# EAGLE design Rev0.1 (EAGLE 7.1.0)
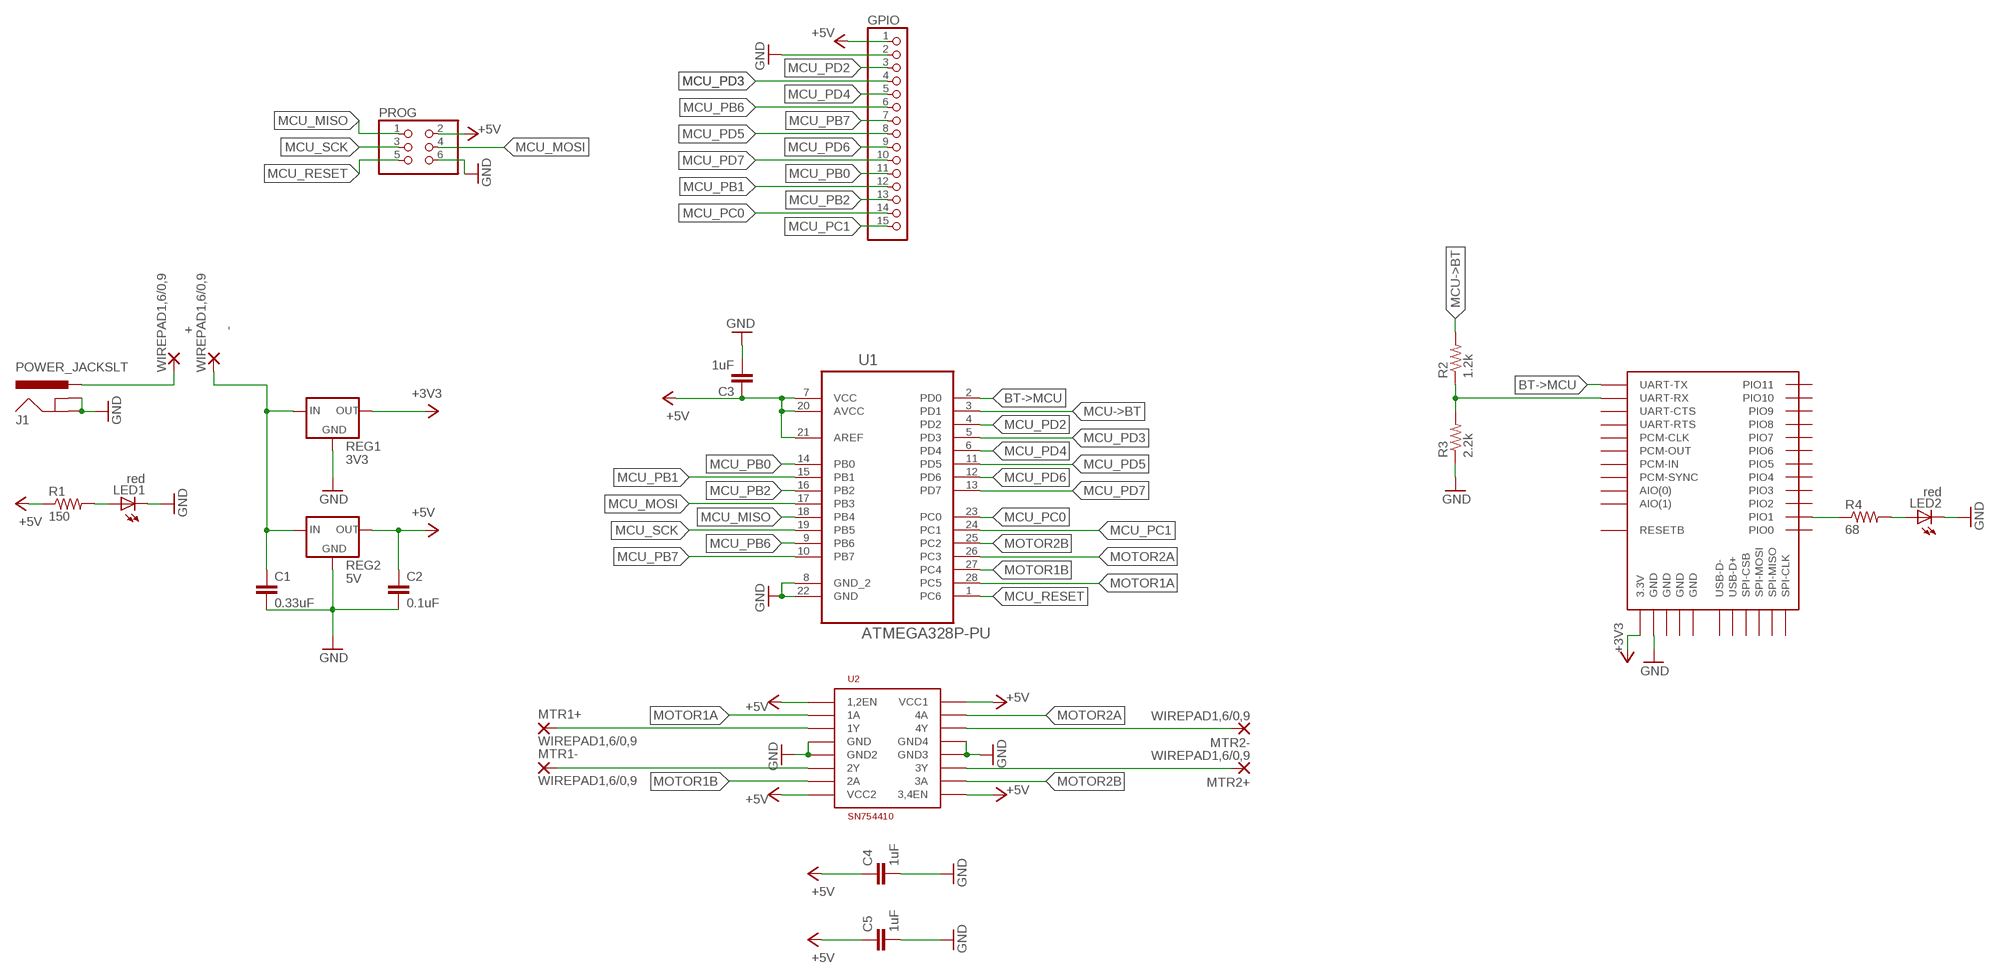
[diagram p0: schematic, sheet 1]

## Parts
+  WIREPAD1,6/0,9  [1,6/0,9]
-  WIREPAD1,6/0,9  [1,6/0,9]
C1  0.33uF  CAP0805  [0805]
C2  0.1uF  CAP0805  [0805]
C3  1uF  CAP0805  [0805]
C4  1uF  CAP0805  [0805]
C5  1uF  CAP0805  [0805]
GPIO  PINHD-1X15  [1X15]
J1  POWER_JACKSLT  [POWER_JACK_SLOT]
LED1  red  LEDCHIP-LED0805  [CHIP-LED0805]
LED2  red  LEDCHIP-LED0805  [CHIP-LED0805]
MTR1+  WIREPAD1,6/0,9  [1,6/0,9]
MTR1-  WIREPAD1,6/0,9  [1,6/0,9]
MTR2+  WIREPAD1,6/0,9  [1,6/0,9]
MTR2-  WIREPAD1,6/0,9  [1,6/0,9]
PROG  PINHD-2X3  [2X03]
R1  150  R-US_R0805  [R0805]
R2  1.2k  R-US_R0805  [R0805]
R3  2.2k  R-US_R0805  [R0805]
R4  68  R-US_R0805  [R0805]
REG1  3V3  LREG_3V3  [TO220V]
REG2  5V  LREG_5V  [TO220V]
U1  ATMEGA328P-PU  [DIP254P762X457-28]
U2  H-BRIDGE  [DIP16]
U$1  BTM400_6B  [BTM400_6B]

## Nets
+3V3 [PWR]: REG1.3(OUT) U$1.3.3V
+5V [PWR]: C2.1 C3.1 C4.1 C5.1 GPIO.1 PROG.2 R1.1 REG2.3(OUT) U1.7(VCC) U1.20(AVCC) U1.21(AREF) U2.P$1(1,2EN) U2.P$8(VCC2) U2.P$9(3,4EN) U2.P$16(VCC1)
BT->MCU: U1.2(PD0) U$1.UART-TX
GND [GND]: C1.2 C2.2 C3.2 C4.2 C5.2 GPIO.2 J1.GND@1(GNDBREAK) J1.GND@2(GND) LED1.C LED2.C PROG.6 R3.1 REG1.2(GND) REG2.2(GND) U1.8(GND_2) U1.22(GND) U2.P$4(GND) U2.P$5(GND2) U2.P$12(GND3) U2.P$13(GND4) U$1.GND@1(GND)
MCU->BT: R2.2 U1.3(PD1)
MCU_MISO: PROG.1 U1.18(PB4)
MCU_MOSI: PROG.4 U1.17(PB3)
MCU_PB0: GPIO.11 U1.14(PB0)
MCU_PB1: GPIO.12 U1.15(PB1)
MCU_PB2: GPIO.13 U1.16(PB2)
MCU_PB6: GPIO.6 U1.9(PB6)
MCU_PB7: GPIO.7 U1.10(PB7)
MCU_PC0: GPIO.14 U1.23(PC0)
MCU_PC1: GPIO.15 U1.24(PC1)
MCU_PD2: GPIO.3 U1.4(PD2)
MCU_PD3: GPIO.4 U1.5(PD3)
MCU_PD4: GPIO.5 U1.6(PD4)
MCU_PD5: GPIO.8 U1.11(PD5)
MCU_PD6: GPIO.9 U1.12(PD6)
MCU_PD7: GPIO.10 U1.13(PD7)
MCU_RESET: PROG.5 U1.1(PC6)
MCU_SCK: PROG.3 U1.19(PB5)
MOTOR1A: U1.28(PC5) U2.P$2(1A)
MOTOR1B: U1.27(PC4) U2.P$7(2A)
MOTOR2A: U1.26(PC3) U2.P$15(4A)
MOTOR2B: U1.25(PC2) U2.P$10(3A)
N$1 [PWR]: -.1(P) C1.1 REG1.1(IN) REG2.1(IN)
N$2: LED1.A R1.2
N$3: +.1(P) J1.PWR
N$4 [PWR]: MTR1+.1(P) U2.P$3(1Y)
N$5: MTR1-.1(P) U2.P$6(2Y)
N$6: MTR2-.1(P) U2.P$14(4Y)
N$7: MTR2+.1(P) U2.P$11(3Y)
N$8: R2.1 R3.2 U$1.UART-RX
N$9: R4.1 U$1.PIO(1)(PIO1)
N$10: LED2.A R4.2
Unconnected: U$1.AIO(0) U$1.AIO(1) U$1.PCM-CLK U$1.PCM-IN U$1.PCM-OUT U$1.PCM-SYNC U$1.PIO(0)(PIO0) U$1.PIO(2)(PIO2) U$1.PIO(3)(PIO3) U$1.PIO(4)(PIO4) U$1.PIO(5)(PIO5) U$1.PIO(6)(PIO6) U$1.PIO(7)(PIO7) U$1.PIO(8)(PIO8) U$1.PIO(9)(PIO9) U$1.PIO(10)(PIO10) U$1.PIO(11)(PIO11) U$1.RESETB U$1.SPI-CLK U$1.SPI-CSB U$1.SPI-MISO U$1.SPI-MOSI U$1.UART-CTS U$1.UART-RTS U$1.USB-D+ U$1.USB-D-

## Power pins joined to a net without a drawn wire
GND: U$1.GND@2(GND) U$1.GND@3(GND) U$1.GND@4(GND)

## Library data of the parts
+ - MTR1+ MTR1- MTR2+ MTR2- = wirepad:WIREPAD: Wire PAD connect wire on PCB
C1-C5 = SparkFun-Capacitors:CAP: Capacitor Standard 0603 ceramic capacitor, and 0.1" leaded capacitor.
GPIO = pinhead:PINHD-1X15: PIN HEADER
J1 = SparkFun-Connectors:POWER_JACK: Power Jack This is the standard 5.5mm barrel jack for power. The PTH is the most common, proven, reliable, footprint. The Slot footprint only works if the mill layer is transmitted to the PCB fab house so be warned. Mating wall wart : TOL-00298 (and others); PROD_ID: PRT-00119
LED1 LED2 = adafruit:LED: LED OSRAM: - CHIPLED LG R971, LG N971, LY N971, LG Q971, LY Q971, LO R971, LY R971 LH N974, LH R974 LS Q976, LO Q976, LY Q976 LO Q996 - Hyper CHIPLED LW Q18S LB Q993, LB Q99A, LB R99A - SideLED LS A670, LO A670, LY A670, LG A670, LP A670 LB A673, LV A673, LT A673, LW A673 LH A674 LY A675 LS A676, LA A676, LO A676, LY A676, LW A676 LS A679, LY A679, LG A679 - Hyper Micro SIDELED® LS Y876, LA Y876, LO Y876, LY Y876 LT Y87S - SmartLED LW L88C, LW L88S LB L89C, LB L89S, LG L890 LS L89K, LO L89K, LY L89K LS L896, LA L896, LO L896, LY L896 - TOPLED LS T670, LO T670, LY T670, LG T670, LP T670 LSG T670, LSP T670, LSY T670, LOP T670, LYG T670 LG T671, LOG T671, LSG T671 LB T673, LV T673, LT T673, LW T673 LH T674 LS T676, LA T676, LO T676, LY T676, LB T676, LH T676, LSB T676, LW T676 LB T67C, LV T67C, LT T67C, LS T67K, LO T67K, LY T67K, LW E67C LS E67B, LA E67B, LO E67B, LY E67B, LB E67C, LV E67C, LT E67C LW T67C LS T679, LY T679, LG T679 LS T770, LO T770, LY T770, LG T770, LP T770 LB T773, LV T773, LT T773, LW T773 LH T774 LS E675, LA E675, LY E675, LS T675 LS T776, LA T776, LO T776, LY T776, LB T776 LHGB T686 LT T68C, LB T68C - Hyper Mini TOPLED® LB M676 - Mini TOPLED Santana® LG M470 LS M47K, LO M47K, LY M47K Source: http://www.osram.convergy.de/
PROG = pinhead:PINHD-2X3: PIN HEADER
R1-R4 = resistor:R-US_: RESISTOR, American symbol
REG1 = BayouBot:LREG_3V3: 3.3V Linear Regulator Vertically mounted 3.3V linear regulator. Pinout is for the UA78M33CKCS.
REG2 = BayouBot:LREG_5V: 5V Linear Regulator A vertically mounted linear regulator. Pinout is for the LM7805CT.
U1 = Atmel_By_element14_Batch_1-00:ATMEGA328P-PU: 8-bit Microcontroller with In-System Programmable Flash; MPN: ATMEGA328P-PU; OC_FARNELL: 1715487; OC_NEWARK: 15R0268; PACKAGE: PDIP-28; SUPPLIER: Atmel
U2 = BayouBot:H-BRIDGE: H Bridge Motor Driver The SN754410 1A Motor Driver
U$1 = BayouBot:BTM400_6B: Bluetooth Chip DealExtreme SKU 80711 bluetooth trasnceiver.

## Net classes
1 GND: width 0.61 mm, clearance 0.305 mm
2 PWR: width 0.61 mm, clearance 0.305 mm

## Board
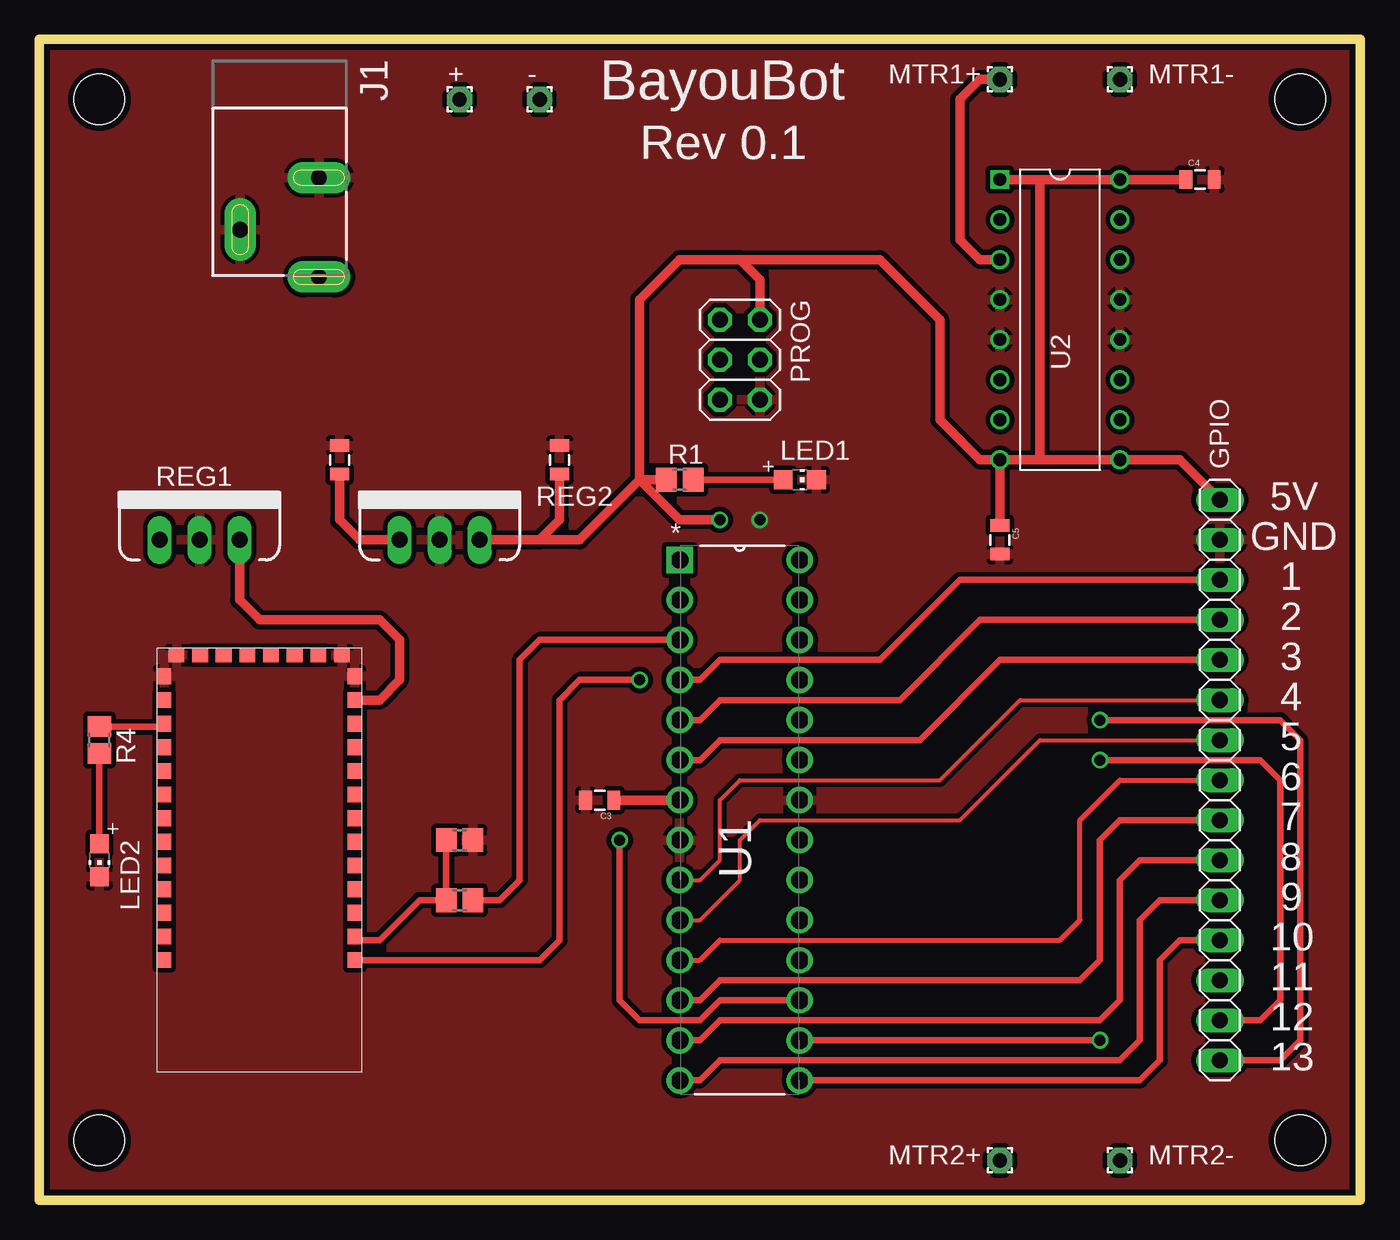
[diagram p1: board, top side]
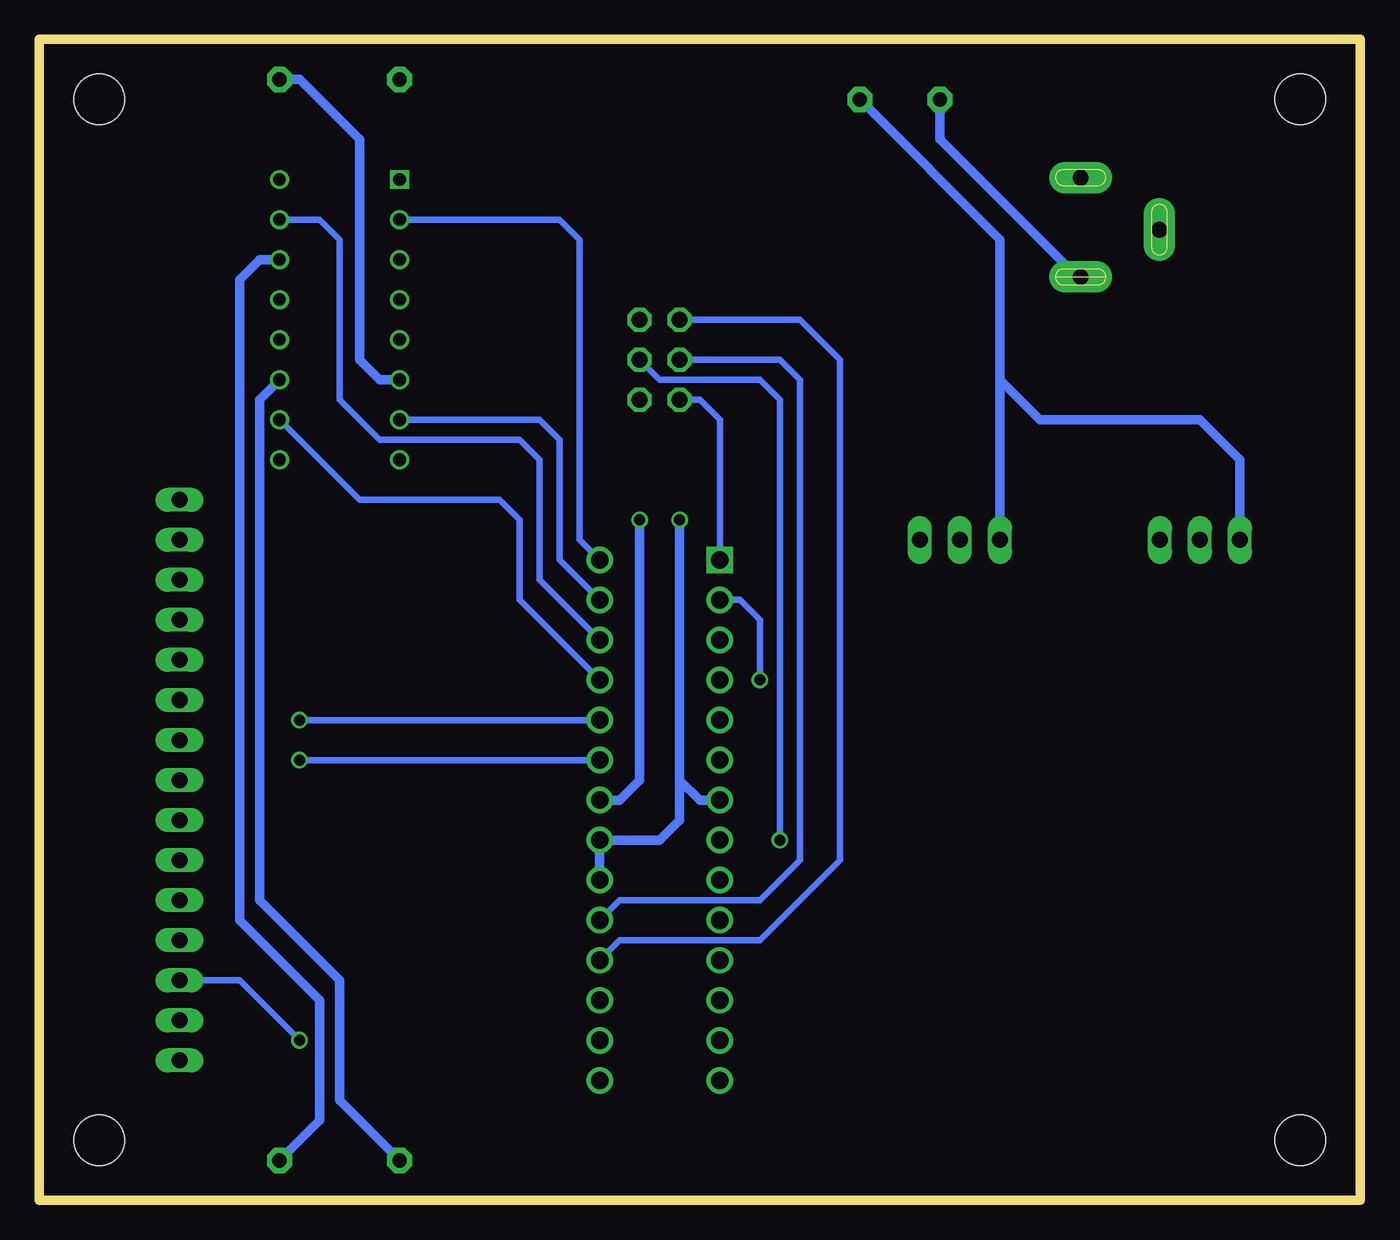
[diagram p2: board, bottom side, seen from below]

Size 83.82 x 73.66 mm. Coordinates in mm from the lower left corner, seen from the top.
Outline: 0,0 0,73.66 83.82,73.66 83.82,0 0,0
Copper layers (1*16): Top 0.0356mm / dielectric 1.5011mm / Bottom 0.0356mm
Design rules "OSHParkRules": minimum track width 6mil, minimum drill 13mil, track to track 6mil, track to pad 6mil, pad to pad 6mil, via to via 6mil, smd to smd 6mil, copper to edge 15mil, drill to drill 6mil, minimum pad ring 7mil, minimum via ring 7mil, stop-mask expansion 3mil, vias tented up to drill 0mil, thermal gap 10mil
Holes 3.2 mm at 80.01,69.85 80.01,3.81 3.81,3.81 3.81,69.85

### Footprints (pad centres in the part's own frame; a part is rotated, then mirrored left to right if it is on the bottom)
1,6/0,9 = drill 0.914 pad 1.6 octagon: 1 0,0
0805 = smd 0.8 x 1.2: 1 -0.9,0; 2 0.9,0
1X15 = drill 1.016 long: 1 -17.78,0; 2 -15.24,0; 3 -12.7,0; 4 -10.16,0; 5 -7.62,0; 6 -5.08,0; 7 -2.54,0; 8 0,0; 9 2.54,0; 10 5.08,0; 11 7.62,0; 12 10.16,0; 13 12.7,0; 14 15.24,0; 15 17.78,0
POWER_JACK_SLOT = drill 1 pad 2 long: GND@1 2.58,7.5; GND@2 7.58,10.8; PWR 2.58,13.8
CHIP-LED0805 = smd 1.2 x 1.2: A 0,-1.05; C 0,1.05
2X03 = drill 1.016 octagon: 1 -2.54,-1.27; 2 -2.54,1.27; 3 0,-1.27; 4 0,1.27; 5 2.54,-1.27; 6 2.54,1.27
R0805 = smd 1.3 x 1.5: 1 -0.85,0; 2 0.85,0
TO220V = drill 1.016 long: 1 -2.54,0; 2 0,0; 3 2.54,0
DIP254P762X457-28 = drill 1.118 square: 1 -7.62,33.02 | drill 1.118: 2 -7.62,30.48; 3 -7.62,27.94; 4 -7.62,25.4; 5 -7.62,22.86; 6 -7.62,20.32; 7 -7.62,17.78; 8 -7.62,15.24; 9 -7.62,12.7; 10 -7.62,10.16; 11 -7.62,7.62; 12 -7.62,5.08; 13 -7.62,2.54; 14 -7.62,0; 15 0,0; 16 0,2.54; 17 0,5.08; 18 0,7.62; 19 0,10.16; 20 0,12.7; 21 0,15.24; 22 0,17.78; 23 0,20.32; 24 0,22.86; 25 0,25.4; 26 0,27.94; 27 0,30.48; 28 0,33.02
DIP16 = drill 0.8 square: P$1 -3.81,8.89 | drill 0.8: P$2 -3.81,6.35; P$3 -3.81,3.81; P$4 -3.81,1.27; P$5 -3.81,-1.27; P$6 -3.81,-3.81; P$7 -3.81,-6.35; P$8 -3.81,-8.89; P$9 3.81,-8.89; P$10 3.81,-6.35; P$11 3.81,-3.81; P$12 3.81,-1.27; P$13 3.81,1.27; P$14 3.81,3.81; P$15 3.81,6.35; P$16 3.81,8.89
BTM400_6B = smd 0.9 x 1: 3.3V -6.05,-10.16; AIO(0) -6.05,-5.66; AIO(1) -6.05,-7.16; GND@1 -6.05,-11.66; GND@4 6.05,-11.66; PCM-CLK -6.05,0.34; PCM-IN -6.05,-2.66; PCM-OUT -6.05,-1.16; PCM-SYNC -6.05,-4.16; PIO(0) 6.05,-10.16; PIO(1) 6.05,-8.66; PIO(2) 6.05,-7.16; PIO(3) 6.05,-5.66; PIO(4) 6.05,-4.16; PIO(5) 6.05,-2.66; PIO(6) 6.05,-1.16; PIO(7) 6.05,0.34; PIO(8) 6.05,1.84; PIO(9) 6.05,3.34; PIO(10) 6.05,4.84; PIO(11) 6.05,6.34; RESETB -6.05,-8.66; UART-CTS -6.05,3.34; UART-RTS -6.05,1.84; UART-RX -6.05,4.84; UART-TX -6.05,6.34 | smd 1 x 0.9: GND@2 -5.23,-13; GND@3 5.27,-13; SPI-CLK 2.27,-13; SPI-CSB -2.23,-13; SPI-MISO 0.77,-13; SPI-MOSI -0.73,-13; USB-D+ 3.77,-13; USB-D- -3.73,-13

### Placement (x,y rotation side)
+  26.67,69.85 0 top
-  31.75,69.85 0 top
C1  19.05,46.99 90 top
C2  33.02,46.99 90 top
C3  35.56,25.4 180 top
C4  73.66,64.77 0 top
C5  60.96,41.91 270 top
GPIO  74.93,26.67 270 top
J1  20.32,72.39 180 top
LED1  48.26,45.72 270 top
LED2  3.81,21.59 180 top
MTR1+  60.96,71.12 0 top
MTR1-  68.58,71.12 0 top
MTR2+  60.96,2.54 0 top
MTR2-  68.58,2.54 0 top
PROG  44.45,53.34 270 top
R1  40.64,45.72 0 top
R2  26.67,19.05 0 top
R3  26.67,22.86 180 top
R4  3.81,29.21 270 top
REG1  10.16,41.91 0 top
REG2  25.4,41.91 0 top
U1  48.26,7.62 0 top
U2  64.77,55.88 0 top
U$1  13.97,21.59 180 top

### Tracks (layer width: path | path; a pad name or v marks a point on that pad's centre or on a via)
+3V3
  Top 0.61: REG1.3 12.7,38.1 13.97,36.83 21.59,36.83 22.86,35.56 22.86,33.02 21.59,31.75 U$1.3.3V
+5V  (via drill 0.7 pad 0.61)
  Top 0.61: REG2.3 31.75,41.91 | 31.75,41.91 33.02,43.18 C2.1 | R1.1 38.1,45.72 | 38.1,45.72 34.29,41.91 31.75,41.91 | PROG.2 45.72,58.42 44.45,59.69 | 44.45,59.69 40.64,59.69 38.1,57.15 38.1,45.72 | 44.45,59.69 53.34,59.69 57.15,55.88 57.15,49.53 59.69,46.99 U2.P$8 | U2.P$8 C5.1 | U2.P$8 63.5,46.99 | 63.5,46.99 U2.P$9 72.39,46.99 GPIO.1 | U2.P$1 63.5,64.77 | 63.5,64.77 63.5,46.99 | 63.5,64.77 U2.P$16 C4.1 | U1.7 C3.1 | v43.18,43.18 40.64,43.18 38.1,45.72
  Bottom 0.61: U1.7 41.91,25.4 43.18,26.67 | 43.18,26.67 v43.18,43.18 | 43.18,26.67 43.18,24.13 44.45,22.86 U1.21 U1.20
BT->MCU  (via drill 0.7 pad 0.41)
  Top 0.406: v38.1,33.02 34.29,33.02 33.02,31.75 33.02,16.51 31.75,15.24 U$1.UART-TX
  Bottom 0.406: U1.2 39.37,38.1 38.1,36.83 v38.1,33.02
GND  (via drill 0.7 pad 0.61)
  Bottom 0.61: U1.22 46.99,25.4 45.72,26.67 v45.72,43.18
  pour Top: 0,73.66 83.82,73.66 83.82,0 1.27,0 0,0
MCU->BT
  Top 0.406: U1.3 31.75,35.56 30.48,34.29 30.48,20.32 29.21,19.05 R2.2
MCU_MISO
  Bottom 0.406: PROG.1 35.56,55.88 33.02,53.34 33.02,21.59 38.1,16.51 46.99,16.51 U1.18
MCU_MOSI  (via drill 0.7 pad 0.41)
  Top 0.406: v36.83,22.86 36.83,12.7 38.1,11.43 41.91,11.43 43.18,12.7 U1.17
  Bottom 0.406: PROG.4 44.45,52.07 38.1,52.07 36.83,50.8 v36.83,22.86
MCU_PB0
  Top 0.406: U1.14 41.91,7.62 43.18,8.89 68.58,8.89 69.85,10.16 69.85,17.78 71.12,19.05 GPIO.11
MCU_PB1
  Top 0.406: U1.15 69.85,7.62 71.12,8.89 71.12,15.24 72.39,16.51 GPIO.12
MCU_PB2  (via drill 0.7 pad 0.41)
  Top 0.406: U1.16 v67.31,10.16
  Bottom 0.406: v67.31,10.16 71.12,13.97 GPIO.13
MCU_PB6
  Top 0.254: U1.9 41.91,20.32 43.18,21.59 43.18,25.4 44.45,26.67 57.15,26.67 62.23,31.75 GPIO.6
MCU_PB7
  Top 0.254: U1.10 41.91,17.78 44.45,20.32 44.45,22.86 45.72,24.13 58.42,24.13 63.5,29.21 GPIO.7
MCU_PC0  (via drill 0.7 pad 0.41)
  Top 0.406: v67.31,27.94 77.47,27.94 78.74,26.67 78.74,12.7 77.47,11.43 GPIO.14
  Bottom 0.406: U1.23 v67.31,27.94
MCU_PC1  (via drill 0.7 pad 0.41)
  Top 0.406: v67.31,30.48 78.74,30.48 80.01,29.21 80.01,10.16 78.74,8.89 GPIO.15
  Bottom 0.406: U1.24 v67.31,30.48
MCU_PD2
  Top 0.406: U1.4 41.91,33.02 43.18,34.29 53.34,34.29 58.42,39.37 GPIO.3
MCU_PD3
  Top 0.406: U1.5 41.91,30.48 43.18,31.75 54.61,31.75 59.69,36.83 GPIO.4
MCU_PD4
  Top 0.406: U1.6 41.91,27.94 43.18,29.21 55.88,29.21 60.96,34.29 GPIO.5
MCU_PD5
  Top 0.305: U1.11 41.91,15.24 43.18,16.51 64.77,16.51 66.04,17.78 66.04,24.13 68.58,26.67 GPIO.8
MCU_PD6
  Top 0.406: U1.12 41.91,12.7 43.18,13.97 66.04,13.97 67.31,15.24 67.31,22.86 68.58,24.13 GPIO.9
MCU_PD7
  Top 0.406: U1.13 41.91,10.16 43.18,11.43 67.31,11.43 68.58,12.7 68.58,20.32 69.85,21.59 GPIO.10
MCU_RESET
  Bottom 0.406: PROG.5 41.91,50.8 40.64,49.53 U1.1
MCU_SCK
  Bottom 0.406: PROG.3 36.83,53.34 35.56,52.07 35.56,21.59 38.1,19.05 46.99,19.05 U1.19
MOTOR1A
  Bottom 0.406: U1.28 49.53,41.91 49.53,60.96 50.8,62.23 U2.P$2
MOTOR1B
  Bottom 0.406: U1.27 50.8,40.64 50.8,48.26 52.07,49.53 U2.P$7
MOTOR2A
  Bottom 0.406: U1.26 52.07,39.37 52.07,46.99 53.34,48.26 62.23,48.26 64.77,50.8 64.77,60.96 66.04,62.23 U2.P$15
MOTOR2B
  Bottom 0.406: U1.25 53.34,38.1 53.34,43.18 54.61,44.45 63.5,44.45 U2.P$10
N$1
  Top 0.61: C1.1 19.05,43.18 20.32,41.91 REG2.1
  Bottom 0.61: -.1 22.86,60.96 22.86,52.07 | 22.86,52.07 REG2.1 | REG1.1 7.62,46.99 10.16,49.53 20.32,49.53 22.86,52.07
N$2
  Top 0.406: R1.2 LED1.A
N$3
  Bottom 0.61: J1.PWR 17.95,58.59 26.67,67.31 +.1
N$4
  Top 0.61: U2.P$3 59.69,59.69 58.42,60.96 58.42,69.85 59.69,71.12 MTR1+.1
N$5
  Bottom 0.61: U2.P$6 62.23,52.07 63.5,53.34 63.5,67.31 67.31,71.12 MTR1-.1
N$6
  Bottom 0.61: MTR2-.1 66.04,5.08 66.04,12.7 71.12,17.78 71.12,58.42 69.85,59.69 U2.P$14
N$7
  Bottom 0.61: MTR2+.1 64.77,6.35 64.77,13.97 69.85,19.05 69.85,50.8 U2.P$11
N$8
  Top 0.406: R3.2 R2.1 24.13,19.05 21.59,16.51 20.26,16.51 U$1.UART-RX
N$9
  Top 0.406: R4.1 7.73,30.06 U$1.PIO(1)
N$10
  Top 0.406: R4.2 LED2.A

### Text on the board
tNames: BayouBot | Rev 0.1 | 5V | GND | 1 | 2 | 3 | 4 | 5 | 6 | 7 | 8 | 9 | 10 | 11 | 12 | 13